# Altium schematic sheet 04-GPS.SchDoc
size A
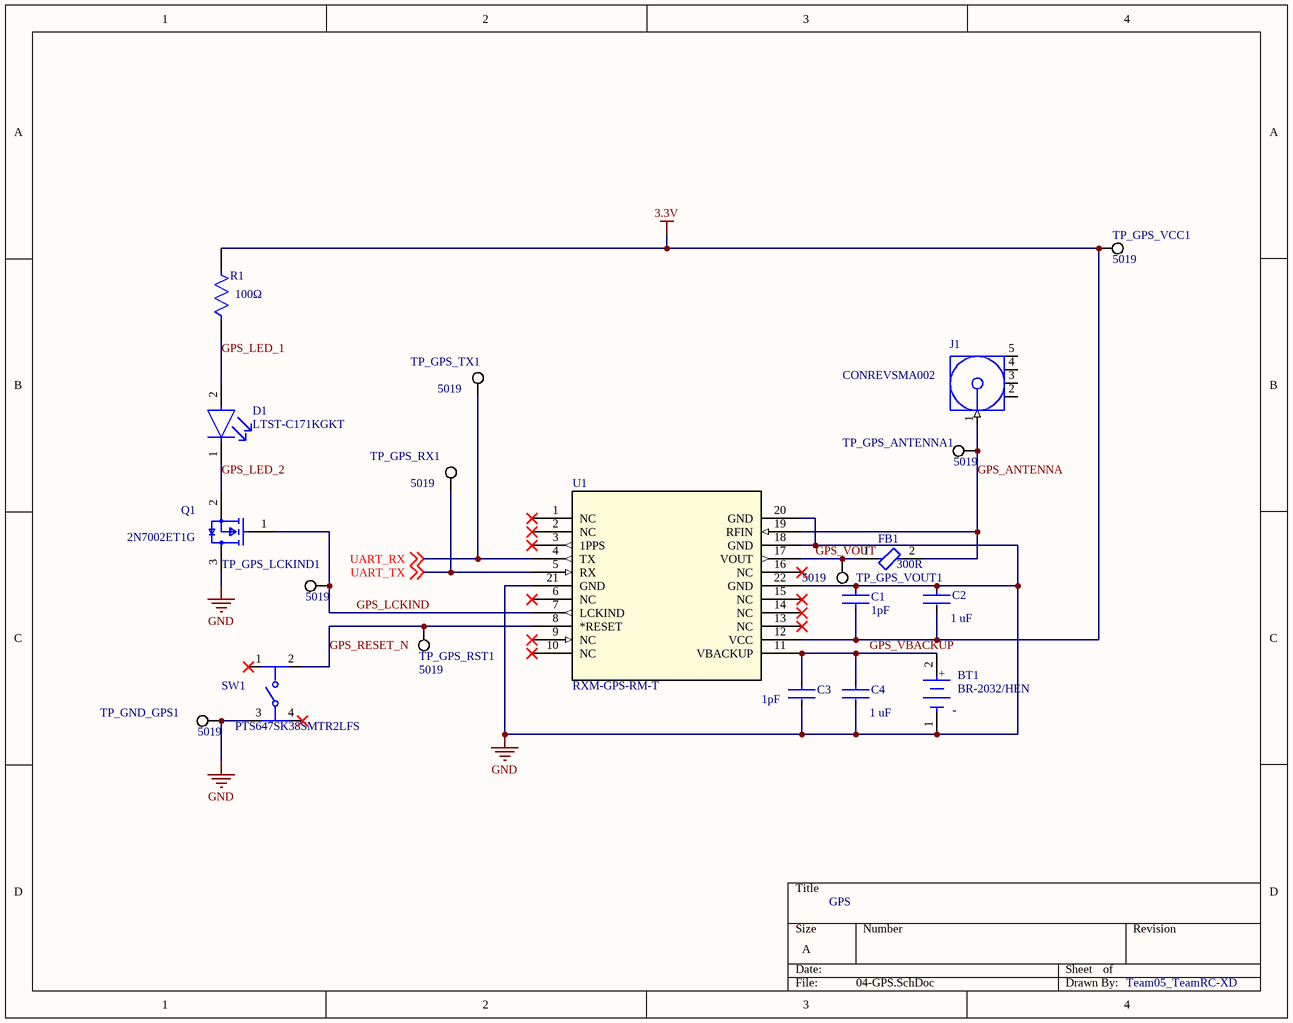
[diagram p0: 04-GPS.SchDoc]

## Parts
BT1  BR-2032/HEN  [FP-BR-2032-HEN-MFG]
C1  Capacitance: 1pF  [FP-CC0805-0_1-0_7-IPC_B]  (hidden comment: CC0805BRNPO9BN1R0)
C2  value 1 uF  [FP-CC0805-0_85-MFG]  (hidden comment: CC0805KKX7R6BB105)
C3  Capacitance: 1pF  [FP-CC0805-0_1-0_7-IPC_B]  (hidden comment: CC0805BRNPO9BN1R0)
C4  value 1 uF  [FP-CC0805-0_85-MFG]  (hidden comment: CC0805KKX7R6BB105)
D1  LTST-C171KGKT  [FP-LTST-C171KGKT-MFG]
FB1  Impedance: 300R  [FP-MMZ1608-0_8-MFG]  (hidden comment: MMZ1608D301BTA00)
J1  CONREVSMA002  [CON-REVSMA-RA]
Q1  2N7002ET1G  [FP-318-08-IPC_A]
R1  value 100Ω  [FP-RN732A-MFG]  (hidden comment: RN73C2A100RBTG)
SW1  PTS647SK38SMTR2LFS  [FP-PTS647SK38SMTR2LFS-MFG]
TP_GND_GPS1  5019  [KSTN-5019_V]
TP_GPS_ANTENNA1  5019  [KSTN-5019_V]
TP_GPS_LCKIND1  5019  [KSTN-5019_V]
TP_GPS_RST1  5019  [KSTN-5019_V]
TP_GPS_RX1  5019  [KSTN-5019_V]
TP_GPS_TX1  5019  [KSTN-5019_V]
TP_GPS_VCC1  5019  [KSTN-5019_V]
TP_GPS_VOUT1  5019  [KSTN-5019_V]
U1  Manufacturer Part Number: RXM-GPS-RM-T  [RXM-GPS-RM-T_LNX]  (hidden comment: GPS)

## Nets
3.3V: C1.1 C2.2 R1.2 TP_GPS_VCC1.1 U1.12(VCC)
GND: BT1.1(C) C1.2 C2.1 C3.2 C4.2 Q1.3(Drain) SW1.3 TP_GND_GPS1.1 U1.18(GND) U1.20(GND) U1.21(GND) U1.22(GND)
GPS_ANTENNA: FB1.2 J1.1(Signal) TP_GPS_ANTENNA1.1 U1.19(RFIN)
GPS_LCKIND: Q1.1(Gate) TP_GPS_LCKIND1.1 U1.7(LCKIND)
GPS_LED_1: D1.2(A) R1.1
GPS_LED_2: D1.1(C) Q1.2(Source)
GPS_RESET_N: SW1.2 TP_GPS_RST1.1 U1.8(*RESET)
GPS_VBACKUP: BT1.2(A) C3.1 C4.1 U1.11(VBACKUP)
GPS_VOUT: FB1.1 TP_GPS_VOUT1.1 U1.17(VOUT)
UART_RX: TP_GPS_TX1.1 U1.4(TX) ; off-sheet UART_RX
UART_TX: TP_GPS_RX1.1 U1.5(RX) ; off-sheet UART_TX

Not connected (* = marked no-connect by the designer): J1 2(GND) 3(GND) 4(GND) 5(GND); SW1 1* 4*; U1 1(NC)* 2(NC)* 3(1PPS)* 6(NC)* 9(NC)* 10(NC)* 13(NC)* 14(NC)* 15(NC)* 16(NC)*

## Notes on the sheet
- GPS
- Team05_TeamRC-XD
- (in symbol CMP-05417-000004-1) +; -

## Library data of the parts
BT1 = CMP-05417-000004-1: BATTERY LITHIUM 3V COIN 20MM; Manufacturer: Panasonic; Standoff Height: 0.45mm; Capacity: 190mAh; Automotive: No; Octopart: https://octopart.com/br-2032%2Fhen-panasonic-11763769; Temperature Range Low: -30°C; Mouser Description: Coin Cell Battery 3V 190mAH 20MM PC PINS; Device Class L3: unset; Digikey Description: BATTERY LITHIUM 3V COIN 20MM; Height: 6.9mm; ComponentLink2Description: Datasheet; Temperature: -30°C to +80°C; Category: Batt; Device Class L1: Passive Components; Device Class L2: unset; Manufacturer Part Number: BR-2032/HEN; Footprint Url: https://www.tme.eu/Document/a4ce6ecb29a556de6bc8b067b4dec6ce/BAT-BR2032HEN.pdf; ComponentLink2URL: https://industrial.panasonic.com/cdbs/www-data/pdf2/AAA4000/AAA4000C222.pdf; Package: BR-2032/HEN; Temperature Range High: +80°C; Supplier 1: Digi-Key; Supplier Part Number 1: P196-ND; RoHS: No; Stock 1: 26447; Pricing 1: 1=1.91000, 20=1.58300, 40=1.47700, 100=1.31800, 360=1.22714, 720=1.15897, 1080=1.09837, 2520=1.03020 (USD); Mount: Through Hole; Weight: 2.5g; Contact Plating: Tin; Min Operating Temperature: -30°C; Max Operating Temperature: 80°C; Chemistry/Technology: Lithium; Output Voltage: 3V; Series: BR2032; Termination: PC Pin; Battery Chemistry: LITHIUM; Voltage Rating: 3V; Package Quantity: 60; Diameter: 20mm; Outside Diameter: 20mm; Lead Free: Lead Free; RoHS Compliant: No; REACH SVHC: Yes; ComponentLink1URL: https://datasheet.ciiva.com/2/panasonic-lithium-cr2032-cr2330-2903.pdf?src-supplier=Digi-Key; ComponentLink1Description: https://datasheet.ciiva.com/2/panasonic-lithium-cr2032-cr2330-2903.pdf?src-supplier=Digi-Key; ComponentLink3URL: https://datasheet.ciiva.com/11715/0900766b810767dc-11715045.pdf?src-supplier=RSComponents; ComponentLink3Description: https://datasheet.ciiva.com/11715/0900766b810767dc-11715045.pdf?src-supplier=RSComponents
C1 C3 = CMP-03422-001522-1: CAP CER 1PF 50V C0G/NPO 0805; Manufacturer: Yageo; Dielectric: C0G; Case Code (Imperial): 0805; Max Operating Temperature: 125°C; Packaging: Tape and Reel; Min Operating Temperature: -55°C; Weight: 0.000194oz; Resistor Type: Ceramic; Voltage Rating: 50V; Thickness: 0.028inch; Width: 0.049inch; Termination: SMD/SMT; RoHS Compliant: Yes; Length: 0.079inch; Voltage Rating (DC): 50V; Mount: Surface Mount; Height: 0.6mm; Case/Package: 0805; Series: CC; Case Code (Metric): 2012; Depth: 1.25mm; Supplier 1: Digi-Key; Supplier Part Number 1: 311-4124-1-ND; Manufacturer Part Number: CC0805BRNPO9BN1R0; RoHS: Yes; Category: Ceramic Capacitors; Stock 1: 21580; Pricing 1: 1=0.15000, 10=0.10900, 50=0.06180, 100=0.05120, 500=0.03592, 1000=0.02974 (USD); ComponentLink1URL: http://www.mouser.com/ds/2/447/Yageo_UPY-GP_NP0_16V-to-50V_9-358835.pdf?src-supplier=Mouser; ComponentLink1Description: http://www.mouser.com/ds/2/447/Yageo_UPY-GP_NP0_16V-to-50V_9-358835.pdf?src-supplier=Mouser; ComponentLink2URL: https://www.yageo.com/upload/media/product/productsearch/datasheet/mlcc/UPY-GP_NP0_16V-to-50V_18.pdf?src-supplier=Digi-Key; ComponentLink2Description: https://www.yageo.com/upload/media/product/productsearch/datasheet/mlcc/UPY-GP_NP0_16V-to-50V_18.pdf?src-supplier=Digi-Key; ComponentLink3URL: http://www.yageo.com/documents/recent/UPY-GP_NP0_16V-to-50V_16.pdf?src-supplier=Digi-Key; ComponentLink3Description: http://www.yageo.com/documents/recent/UPY-GP_NP0_16V-to-50V_16.pdf?src-supplier=Digi-Key; ComponentLink4URL: http://www.yageo.com/documents/recent/UPY-GP_NP0_16V-to-50V_8.pdf?src-supplier=Avnet; ComponentLink4Description: http://www.yageo.com/documents/recent/UPY-GP_NP0_16V-to-50V_8.pdf?src-supplier=Avnet; ComponentLink5URL: http://www.yageo.com/exep/pages/download/literatures/ProductSelectionGuide%202014_Final_2.pdf?src-supplier=Digi-Key; ComponentLink5Description: http://www.yageo.com/exep/pages/download/literatures/ProductSelectionGuide%202014_Final_2.pdf?src-supplier=Digi-Key
C2 C4 = CMP-03422-000182-1: CAP CER 1UF 10V X7R 0805; Manufacturer: Yageo; Material: Ceramic; Tolerance: 0.1; ComponentLink2URL: http://www.yageo.com/documents/recent/UPY-GPHC_Y5V_6.3V-to-50V_8.pdf; Automotive: No; Temperature Range Low: -30°C; Octopart: https://octopart.com/cc0805kkx7r6bb105-yageo-42522859; Temperature Characteristic: X7R; RoHS: TRUE; Voltage Rating: 10 V; Capacitance: 1 uF; Package: CC0805-0.85; Device Class L3: Ceramic Capacitors; Category: Cap; Mouser Description: Multilayer Ceramic Capacitors MLCC - SMD/SMT 1.0uF 10V X7R 10%; Temperature Range High: +85°C; Ipc Land Pattern Name: CAPC200125X85; Manufacturer Part Number: CC0805KKX7R6BB105; ComponentLink2Description: Datasheet; Temperature: -30°C to +85°C; Height: 0.95mm; Lead Free: Yes; Device Class L1: Passive Components; Device Class L2: Capacitors; Footprint Url: http://www.yageo.com/exep/pages/download/literatures/UPY-C_GEN_24.pdf; Digikey Description: CAP CER 1UF 10V X7R 0805; Supplier 1: Digi-Key; Supplier Part Number 1: 311-1458-1-ND; Stock 1: 128565; Pricing 1: 1=0.14000, 10=0.10300, 50=0.05860, 100=0.04850, 500=0.03400, 1000=0.02815 (USD); Mount: Surface Mount; Case/Package: 0805; Number of Pins: 2; Case Code (Imperial): 0805; Case Code (Metric): 2012; Dielectric Material: Ceramic; Min Operating Temperature: -55°C; Max Operating Temperature: 125°C; Voltage Rating (DC): 10V; Packaging: Tape and Reel; Package Quantity: 1; Dielectric: X7R; Termination: SMD/SMT; Series: CC; Resistor Type: Ceramic; Length: 2mm; Width: 1.25mm; Thickness: 0.057inch; Depth: 1.25mm; Radiation Hardening: No; REACH SVHC: Unknown; RoHS Compliant: Yes; Halogen Free: Halogen Free; ComponentLink1URL: https://datasheet.ciiva.com/7978/1489800-7978199.pdf?src-supplier=Element14; ComponentLink1Description: https://datasheet.ciiva.com/7978/1489800-7978199.pdf?src-supplier=Element14; ComponentLink3URL: https://datasheet.ciiva.com/28450/1489800-28450742.pdf?src-supplier=Element14; ComponentLink3Description: https://datasheet.ciiva.com/28450/1489800-28450742.pdf?src-supplier=Element14; ComponentLink4URL: https://datasheet.ciiva.com/46430/1734573-46430165.pdf?src-supplier=Element14; ComponentLink4Description: https://datasheet.ciiva.com/46430/1734573-46430165.pdf?src-supplier=Element14; ComponentLink5URL: https://datasheet.ciiva.com/176/mlccorderingcode-176908.pdf?src-supplier=Digi-Key; ComponentLink5Description: https://datasheet.ciiva.com/176/mlccorderingcode-176908.pdf?src-supplier=Digi-Key; ComponentLink6URL: https://datasheet.ciiva.com/176/mlccorderingcode-176907.pdf?src-supplier=Digi-Key; ComponentLink6Description: https://datasheet.ciiva.com/176/mlccorderingcode-176907.pdf?src-supplier=Digi-Key; ComponentLink7URL: https://datasheet.ciiva.com/176/mlccorderingcode-176909.pdf?src-supplier=Digi-Key; ComponentLink7Description: https://datasheet.ciiva.com/176/mlccorderingcode-176909.pdf?src-supplier=Digi-Key; ComponentLink8URL: https://datasheet.ciiva.com/8033/1489800-8033973.pdf?src-supplier=Element14; ComponentLink8Description: https://datasheet.ciiva.com/8033/1489800-8033973.pdf?src-supplier=Element14; ComponentLink9URL: https://datasheet.ciiva.com/8033/1489800-8033998.pdf?src-supplier=Element14; ComponentLink9Description: https://datasheet.ciiva.com/8033/1489800-8033998.pdf?src-supplier=Element14; ComponentLink10URL: https://datasheet.ciiva.com/13389/upy-gp-np0-16v-to-50v-8-13389349.pdf?src-supplier=Mouser; ComponentLink10Description: https://datasheet.ciiva.com/13389/upy-gp-np0-16v-to-50v-8-13389349.pdf?src-supplier=Mouser; ComponentLink11URL: https://datasheet.ciiva.com/11583/upy-gphc-x7r-6-3v-to-50v-8-11583596.pdf?src-supplier=Avnet; ComponentLink11Description: https://datasheet.ciiva.com/11583/upy-gphc-x7r-6-3v-to-50v-8-11583596.pdf?src-supplier=Avnet
D1 = CMP-22017-000037-1: LED GREEN CLEAR SMD; Manufacturer: Vishay Lite-On; Number of LEDs: 1; Viewing Angle: 130°; Lens Style: Rectangular; Dominant Wavelength: 571nm; Test Current: 20mA; Luminous Intensity: 35mcd; Power Rating: 75mW; Forward Voltage: 2.4V; Forward Current: 30mA; Reverse Voltage: 5V; Lens Color: Colorless; Wavelength: 574nm; Height: 0.8mm; Illumination Color: Green; Length: 2mm; Case/Package: 0805; Number of Pins: 2; Number of Elements: 1; Package Quantity: 1; Depth: 1.25mm; Lens Transparency: Clear; Width: 1.25mm; Color: Green; Radiation Hardening: No; Mount: Surface Mount; Packaging: Tape and Reel; Case Code (Metric): 2012; Lead Free: Lead Free; Max Operating Temperature: 85°C; Min Operating Temperature: -55°C; Case Code (Imperial): 0805; Power Dissipation: 75mW; Supplier 1: Digi-Key; Supplier Part Number 1: 160-1426-1-ND; Manufacturer Part Number: LTST-C171KGKT; RoHS: Yes; Category: LEDs; Stock 1: 203195; Pricing 1: 1=0.28000, 10=0.15000, 100=0.06990, 500=0.06450, 1000=0.05052 (USD); Series: CHIPLED 0805; RoHS Compliant: Yes; ComponentLink1URL: https://datasheet.ciiva.com/11774/0900766b80dc0298-11774377.pdf?src-supplier=RSComponents; ComponentLink1Description: https://datasheet.ciiva.com/11774/0900766b80dc0298-11774377.pdf?src-supplier=RSComponents; ComponentLink2URL: https://datasheet.ciiva.com/12400/lite-on-ltst-c171kgkt-187692-12400799.pdf?src-supplier=Mouser; ComponentLink2Description: https://datasheet.ciiva.com/12400/lite-on-ltst-c171kgkt-187692-12400799.pdf?src-supplier=Mouser; ComponentLink3URL: https://datasheet.ciiva.com/16200/lite-on20ltst-c171kgkt-16200100.pdf?src-supplier=Future+Electronics; ComponentLink3Description: https://datasheet.ciiva.com/16200/lite-on20ltst-c171kgkt-16200100.pdf?src-supplier=Future+Electronics; ComponentLink4URL: https://datasheet.ciiva.com/15118/getdatasheetpartid-214542-15118099.pdf?src-supplier=Verical; ComponentLink4Description: https://datasheet.ciiva.com/15118/getdatasheetpartid-214542-15118099.pdf?src-supplier=Verical; ComponentLink5URL: https://datasheet.ciiva.com/2110/s-110-ltst-c171kgkt-2110073.pdf?src-supplier=Digi-Key; ComponentLink5Description: https://datasheet.ciiva.com/2110/s-110-ltst-c171kgkt-2110073.pdf?src-supplier=Digi-Key; ComponentLink6URL: https://datasheet.ciiva.com/2110/s-110-ltst-c171kgkt-2110072.pdf?src-supplier=Digi-Key; ComponentLink6Description: https://datasheet.ciiva.com/2110/s-110-ltst-c171kgkt-2110072.pdf?src-supplier=Digi-Key; ComponentLink7URL: https://datasheet.ciiva.com/2110/s-110-ltst-c171kgkt-2110074.pdf?src-supplier=Digi-Key; ComponentLink7Description: https://datasheet.ciiva.com/2110/s-110-ltst-c171kgkt-2110074.pdf?src-supplier=Digi-Key
FB1 = CMP-08257-000452-1: Signal Line Ferrite Bead 300Ω  @ 100MHz 300mA DCR 700mΩ SMD 0603; Manufacturer: TDK; DC Resistance (DCR): 700mR; Case/Package: 0603; Max DC Current: 300mA; REACH SVHC: No SVHC; Case Code (Imperial): 0603; Case Code (Metric): 1608; Length: 0.063inch; Mount: Surface Mount; RoHS Compliant: Yes; Current Rating: 300mA; Packaging: Cut Tape; Width: 0.031inch; Height: 0.037inch; Package Quantity: 4000; Series: MMZ; Supplier 1: TTI; Supplier Part Number 1: MMZ1608D301BTA00; Manufacturer Part Number: MMZ1608D301BTA00; RoHS: Yes; Category: Ferrite Beads and Chips; Stock 1: 32000; Pricing 1: 4000=0.02570, 8000=0.02510, 12000=0.02470, 28000=0.02420 (USD); ComponentLink1URL: https://datasheet.ciiva.com/46634/beads-commercial-signal-mmz-en-46634382.pdf?src-supplier=Digi-Key; ComponentLink1Description: https://datasheet.ciiva.com/46634/beads-commercial-signal-mmz-en-46634382.pdf?src-supplier=Digi-Key; ComponentLink2URL: https://datasheet.ciiva.com/46390/714910-46390570.pdf?src-supplier=Element14; ComponentLink2Description: https://datasheet.ciiva.com/46390/714910-46390570.pdf?src-supplier=Element14; ComponentLink3URL: https://datasheet.ciiva.com/46381/714910-46381639.pdf?src-supplier=Element14; ComponentLink3Description: https://datasheet.ciiva.com/46381/714910-46381639.pdf?src-supplier=Element14
J1 = CMP-0168-00005-1: RP-SMA Female Right Angle PCB Mount Connector, Thru-Hole; Manufacturer: Linx; Body Material: Brass; Body Plating: Nickel; Dielectric Material: PTFE; Center Contact Plating: Gold; Impedance: 50R; Connector Type: SMA,Receptacle,Male Pin; Polarity: Reverse; PackageDescription: RP-SMA Female Right Angle, PCB Mount Connector, Thru-Hole, 7 x 7 mm Body; PackageReference: CON-REVSMA-RA; PackageVersion: rev1.0, Mar-2005; DatasheetVersion: rev1.0, Mar-2005; Supplier 1: Digi-Key; Supplier Part Number 1: CONREVSMA002-ND; Manufacturer Part Number: CONREVSMA002; RoHS: Yes; Category: RF / Coaxial Connectors; Stock 1: 16726; Pricing 1: 1=3.08000, 10=2.81000, 25=2.69000, 100=2.65000, 250=2.60000, 500=2.56000, 1000=2.19001, 5000=1.87200 (USD); Mount: Through Hole; Case/Package: SMA; Contact Material: Copper; Contact Plating: Gold; Plating: Nickel; Housing Color: Silver; Min Operating Temperature: -65°C; Max Operating Temperature: 165°C; Series: -; Package Quantity: 100; Packaging: Bulk; Termination: Solder; Fastening Type: Threaded; Orientation: Right Angle; Length: 15.1mm; RoHS Compliant: Yes; Lead Free: Lead Free; ComponentLink1URL: https://datasheet.ciiva.com/644/conrevsma002-644109.pdf?src-supplier=Digi-Key; ComponentLink1Description: https://datasheet.ciiva.com/644/conrevsma002-644109.pdf?src-supplier=Digi-Key; ComponentLink2URL: https://datasheet.ciiva.com/16225/conrevsma002-16225213.pdf?src-supplier=Future+Electronics; ComponentLink2Description: https://datasheet.ciiva.com/16225/conrevsma002-16225213.pdf?src-supplier=Future+Electronics
Q1 = CMP-1058-00769-2: MOSFET N-CH 60V 260MA SOT-23; Manufacturer: ON Semiconductor; On-State Resistance: 2.5R; Turn-Off Delay Time: 4.8ns; Nominal Vgs: 1V; Element Configuration: Single; Rise Time: 1.2ns; Input Capacitance: 26.7pF; Number of Elements: 1; Turn-On Delay Time: 1.7ns; Gate to Source Voltage (Vgs): 20V; Max Power Dissipation: 300mW; Polarity: N-CHANNEL; Drain to Source Breakdown Voltage: 60V; Max Operating Temperature: 150°C; REACH SVHC: No SVHC; Case/Package: SOT-23-3; Lead Free: Lead Free; Length: 2.9mm; Height: 0.94mm; Package Quantity: 3000; Min Operating Temperature: -55°C; Radiation Hardening: No; Packaging: Tape and Reel; Fall Time: 1.2ns; Drain to Source Resistance: 2.5R; Halogen Free: Halogen Free; Threshold Voltage: 1V; Number of Pins: 3; Continuous Drain Current (ID): 260mA; Rds On Max: 2.5R; Power Dissipation: 300mW; Width: 1.3mm; Supplier 1: Digi-Key; Supplier Part Number 1: 2N7002ET1GOSCT-ND; Manufacturer Part Number: 2N7002ET1G; RoHS: Yes; Category: MOSFETs; Stock 1: 934829; Pricing 1: 1=0.25000, 10=0.20300, 100=0.10780, 500=0.07096, 1000=0.04825 (USD); Series: -; Drain-source On Resistance-Max: 2.5R; RoHS Compliant: Yes; ComponentLink1Description: https://www.digikey.com/en/products/detail/2N7002ET1G/2N7002ET1GOSCT-ND/1967029?curr=usd&utm_campaign=buynow&utm_medium=aggregator&utm_source=octopart; ComponentLink1URL: https://www.digikey.com/en/products/detail/2N7002ET1G/2N7002ET1GOSCT-ND/1967029?curr=usd&utm_campaign=buynow&utm_medium=aggregator&utm_source=octopart
R1 = CMP-03211-001241-1: SMD Chip Resistor, Thin Film, 100Ω, 100 V, 0805 [2012 Metric], 100 mW, 0.1%, RN73 Series; Manufacturer: TE Connectivity; Temperature Coefficient: 10ppm/°C; Voltage Rating: 100V; Power Rating: 0.1W; Device Class L1: Passive Components; Temperature: -55°C to 155°C; RoHS: TRUE; Height: 0.65mm; ComponentLink2Description: Datasheet; Device Class L3: Chip SMD Resistors; Device Class L2: Resistors; Octopart: https://octopart.com/rn73c2a100rbtg-te+connectivity-41195811; Category: Res; ComponentLink2URL: https://www.te.com/commerce/DocumentDelivery/DDEController?Action=showdoc&DocId=Data+Sheet%7F1773270%7FP%7Fpdf%7FEnglish%7FENG_DS_1773270_P.pdf%7F1676162-2; Temperature Range Low: -55°C; Series: RN73; Lead Free: Yes; packaging: 250 cut tape length; octopart_url: https://octopart.com/rn73c2a100rbtg-te+connectivity-41195811; Package: RN732A; Manufacturer Part Number: RN73C2A100RBTG; Composition: Thin Film; Tolerance: 0.1%; Temperature Range High: 155°C; Ipc Land Pattern Name: RESC200125X55; Automotive: No; Resistance: 100Ω
SW1 = CMP-10040-000033-1: TACT 4.5 X 4.5, 3.8 MM H, 2.5N,; Manufacturer: ITT C&K; Switch Function: Off-Mom; Switch Travel: 0.25mm; Actuator Type: Standard; Illumination Type: Non-Illuminated; Mechanical Life: 100000Cycles; Ratings: IP40; Operating Force: 250gf; Throw Configuration: SPST; Max Operating Temperature: 70°C; Min Operating Temperature: -20°C; Termination: Gull Wing; Mount: Surface Mount; Packaging: Tape and Reel; Supplier 1: Digi-Key; Supplier Part Number 1: PTS647SK38SMTR2LFSCT-ND; Manufacturer Part Number: PTS647SK38SMTR2LFS; RoHS: No; Category: Tactile Switches; Stock 1: 83225; Pricing 1: 1=0.21000, 10=0.20200, 25=0.19120, 100=0.17390, 250=0.16344, 500=0.14954, 1000=0.12519 (USD); ComponentLink1URL: https://www.ckswitches.com/media/2567/pts647.pdf?src-supplier=Digi-Key; ComponentLink1Description: https://www.ckswitches.com/media/2567/pts647.pdf?src-supplier=Digi-Key
TP_GND_GPS1 TP_GPS_ANTENNA1 TP_GPS_LCKIND1 TP_GPS_RST1 TP_GPS_RX1 TP_GPS_TX1 TP_GPS_VCC1 TP_GPS_VOUT1 = CMP-1672-00008-1: Test Point, 1 Position SMD, RoHS, Tape and Reel; Manufacturer: Keystone Electronics; ComponentLink1Description: Manufacturer URL; Package Quantity: 1000; DatasheetVersion: 03/2014; Packaging: Tape and Reel; ComponentLink2URL: http://www.keyelco.com/product-pdf.cfm?p=1357; ComponentLink1URL: http://www.keyelco.com/; Mount: Surface Mount; Contact Plating: Silver; PackageDescription: 1-Pin Surface Mount Device, Body 3.81 x 2.03 mm; Pins: 1; RoHSCompliant: True; Mounting Technology: Surface Mount; ComponentLink2Description: Datasheet; PackageReference: 5019; Supplier 1: Digi-Key; Supplier Part Number 1: 36-5019CT-ND; Manufacturer Part Number: 5019; RoHS: Yes; Category: Connectors; Stock 1: 1293364; Pricing 1: 1=0.34000, 25=0.27360, 100=0.22340, 250=0.20064, 500=0.19152 (USD); Number of Pins: 1; Material: Bronze; Contact Material: Bronze; Termination: SMD/SMT; Series: 5019; Height: 0.09inch; REACH SVHC: No SVHC; RoHS Compliant: Yes; Lead Free: Lead Free; ComponentLink3URL: https://datasheet.ciiva.com/16318/m60-2p61-16318395.pdf?src-supplier=Future+Electronics; ComponentLink3Description: https://datasheet.ciiva.com/16318/m60-2p61-16318395.pdf?src-supplier=Future+Electronics; ComponentLink4URL: https://datasheet.ciiva.com/16885/70182998-16885945.pdf?src-supplier=Allied+Electronics; ComponentLink4Description: https://datasheet.ciiva.com/16885/70182998-16885945.pdf?src-supplier=Allied+Electronics; ComponentLink5URL: https://datasheet.ciiva.com/14848/m60-2p61-14848437.pdf?src-supplier=Digi-Key; ComponentLink5Description: https://datasheet.ciiva.com/14848/m60-2p61-14848437.pdf?src-supplier=Digi-Key; ComponentLink6URL: https://datasheet.ciiva.com/14848/m60-2p61-14848438.pdf?src-supplier=Digi-Key; ComponentLink6Description: https://datasheet.ciiva.com/14848/m60-2p61-14848438.pdf?src-supplier=Digi-Key; ComponentLink7URL: https://datasheet.ciiva.com/14848/m60-2p61-14848439.pdf?src-supplier=Digi-Key; ComponentLink7Description: https://datasheet.ciiva.com/14848/m60-2p61-14848439.pdf?src-supplier=Digi-Key
U1 = GPS: RM Series GPS Receiver Module - Tape & Reel; Manufacturer: Linx; Frequency: 1.57542GHz; Interface: Serial; Number of Channels: 66; Operating Supply Current: 12mA; Operating Supply Voltage: 4.3V; Supplier 1: Digi-Key; Supplier Part Number 1: RXM-GPS-RM-TCT-ND; RoHS: Yes; Category: RF Receivers, Transceivers; Stock 1: 2415; Pricing 1: 1=37.33000, 10=33.62000, 25=31.77000, 100=29.93010, 250=28.94008, 500=27.97002 (USD); Case/Package: Module; Min Operating Temperature: -40°C; Max Operating Temperature: 85°C; Package Quantity: 1000; Packaging: Tape and Reel; Current - Receiving: 12mA; RoHS Compliant: Yes; ComponentLink1URL: https://datasheet.ciiva.com/29639/mdev-gps-29639669.pdf?src-supplier=Digi-Key; ComponentLink1Description: https://datasheet.ciiva.com/29639/mdev-gps-29639669.pdf?src-supplier=Digi-Key; ComponentLink2URL: https://datasheet.ciiva.com/29639/mdev-gps-29639670.pdf?src-supplier=Digi-Key; ComponentLink2Description: https://datasheet.ciiva.com/29639/mdev-gps-29639670.pdf?src-supplier=Digi-Key; ComponentLink3URL: https://datasheet.ciiva.com/29639/mdev-gps-29639671.pdf?src-supplier=Digi-Key; ComponentLink3Description: https://datasheet.ciiva.com/29639/mdev-gps-29639671.pdf?src-supplier=Digi-Key